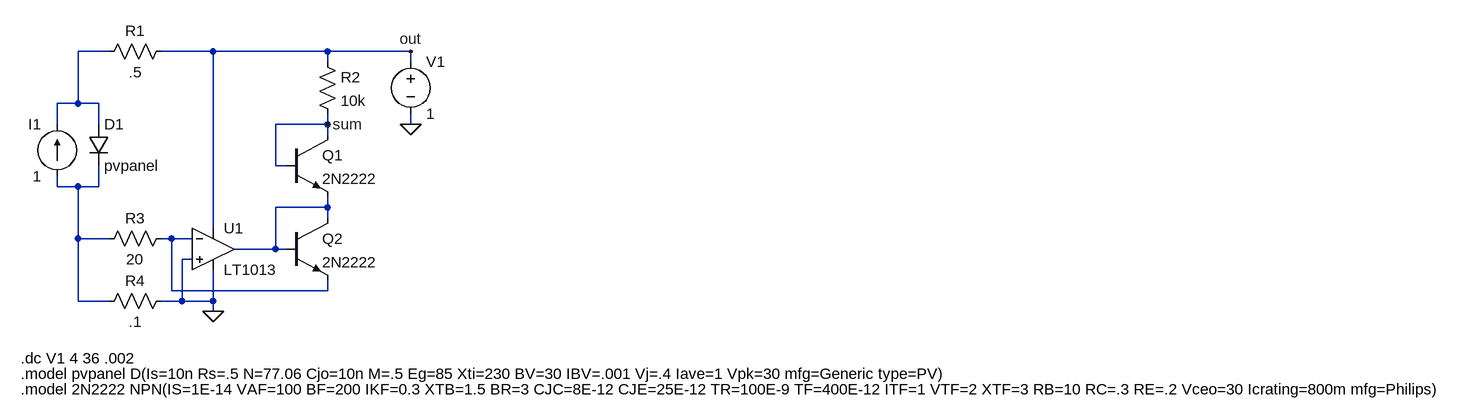
[diagram p0: schematic pvmonitor.asc]
pvmonitor.asc, the LTspice schematic file:
Version 4
SHEET 1 2232 680
WIRE 192 16 144 16
WIRE 352 16 272 16
WIRE 528 16 352 16
WIRE 656 16 528 16
WIRE 528 32 528 16
WIRE 656 32 656 16
WIRE 144 96 144 16
WIRE 144 96 112 96
WIRE 176 96 144 96
WIRE 112 128 112 96
WIRE 176 128 176 96
WIRE 528 128 528 112
WIRE 528 128 448 128
WIRE 656 128 656 112
WIRE 528 144 528 128
WIRE 448 192 448 128
WIRE 464 192 448 192
WIRE 112 224 112 208
WIRE 144 224 112 224
WIRE 176 224 176 192
WIRE 176 224 144 224
WIRE 528 256 528 240
WIRE 528 256 448 256
WIRE 528 272 528 256
WIRE 352 288 352 16
WIRE 144 304 144 224
WIRE 192 304 144 304
WIRE 288 304 272 304
WIRE 320 304 288 304
WIRE 448 320 448 256
WIRE 448 320 384 320
WIRE 464 320 448 320
WIRE 320 336 304 336
WIRE 288 384 288 304
WIRE 528 384 528 368
WIRE 528 384 288 384
WIRE 144 400 144 304
WIRE 192 400 144 400
WIRE 304 400 304 336
WIRE 304 400 272 400
WIRE 352 400 352 352
WIRE 352 400 304 400
WIRE 352 416 352 400
FLAG 656 16 out
FLAG 656 128 0
FLAG 352 416 0
FLAG 528 128 sum
SYMBOL current 112 208 R180
WINDOW 0 24 80 Left 2
WINDOW 3 24 0 Left 2
SYMATTR InstName I1
SYMATTR Value 1
SYMBOL Diode 160 128 R0
SYMATTR InstName D1
SYMATTR Value pvpanel
SYMBOL Res 288 0 R90
WINDOW 0 0 56 VBottom 2
WINDOW 3 32 56 VTop 2
SYMATTR InstName R1
SYMATTR Value .5
SYMBOL Res 512 16 R0
SYMATTR InstName R2
SYMATTR Value 10k
SYMBOL Res 288 288 R90
WINDOW 0 0 56 VBottom 2
WINDOW 3 32 56 VTop 2
SYMATTR InstName R3
SYMATTR Value 20
SYMBOL Res 288 384 R90
WINDOW 0 0 56 VBottom 2
WINDOW 3 32 56 VTop 2
SYMATTR InstName R4
SYMATTR Value .1
SYMBOL npn 464 144 R0
SYMATTR InstName Q1
SYMATTR Value 2N2222
SYMBOL npn 464 272 R0
SYMATTR InstName Q2
SYMATTR Value 2N2222
SYMBOL OpAmps/LT1013 352 256 R0
SYMATTR InstName U1
SYMBOL voltage 656 16 R0
SYMATTR InstName V1
SYMATTR Value 1
TEXT 56 512 Left 2 !.model pvpanel D(Is=10n Rs=.5 N=77.06 Cjo=10n M=.5 Eg=85 Xti=230 BV=30 IBV=.001 Vj=.4 Iave=1 Vpk=30 mfg=Generic type=PV)
TEXT 56 536 Left 2 !.model 2N2222 NPN(IS=1E-14 VAF=100 BF=200 IKF=0.3 XTB=1.5 BR=3 CJC=8E-12 CJE=25E-12 TR=100E-9 TF=400E-12 ITF=1 VTF=2 XTF=3 RB=10 RC=.3 RE=.2 Vceo=30 Icrating=800m mfg=Philips)
TEXT 56 488 Left 2 !.dc V1 4 36 .002

The netlist it stands for:
* pvmonitor.asc
I1 N002 N001 1
D1 N001 N002 pvpanel
R1 out N001 .5
R2 out sum 10k
R3 N004 N002 20
R4 0 N002 .1
Q1 sum sum N003 0 2N2222
Q2 N003 N003 N004 0 2N2222
XU1 0 N004 out 0 N003 LT1013  ; pins In+ In- V+ V- OUT
V1 out 0 1
.model D D
.lib standard.dio
.model NPN NPN
.model PNP PNP
.lib standard.bjt
.model pvpanel D(Is=10n Rs=.5 N=77.06 Cjo=10n M=.5 Eg=85 Xti=230 BV=30 IBV=.001 Vj=.4 Iave=1 Vpk=30 mfg=Generic type=PV)
.model 2N2222 NPN(IS=1E-14 VAF=100 BF=200 IKF=0.3 XTB=1.5 BR=3 CJC=8E-12 CJE=25E-12 TR=100E-9 TF=400E-12 ITF=1 VTF=2 XTF=3 RB=10 RC=.3 RE=.2 Vceo=30 Icrating=800m mfg=Philips)
.dc V1 4 36 .002
.lib LTC.lib
.backanno
.end